# Altium schematic sheet W25Q128.SchDoc
size A4
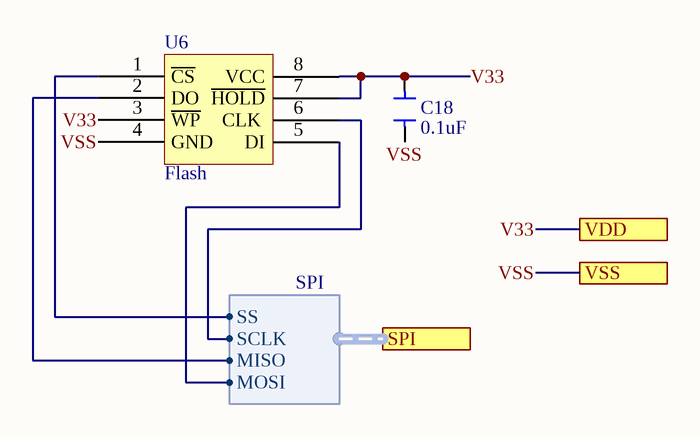
[diagram p0: W25Q128.SchDoc]

## Parts
C18  value 0.1uF  [CAP_0402]  (hidden comment: Cap)
U6  Flash  [8-Pin SOIC 208-mil]

## Ports
SPI (harness SPI), VDD, VSS

## Harnesses
SPI: SS, MISO, MOSI, SCLK

## Nets
V33: C18.1 U6.3(~{WP}) U6.7(~{HOLD}) U6.8(VCC) ; port VDD
VSS: C18.2 U6.4(GND) ; port VSS
NetU6_1: U6.1(~{CS}) ; port SPI.SS
NetU6_2: U6.2(DO) ; port SPI.MISO
NetU6_5: U6.5(DI) ; port SPI.MOSI
NetU6_6: U6.6(CLK) ; port SPI.SCLK

## Library data of the parts
U6 = W25QXX